# EAGLE design RGBdriverModule (EAGLE 4.16)
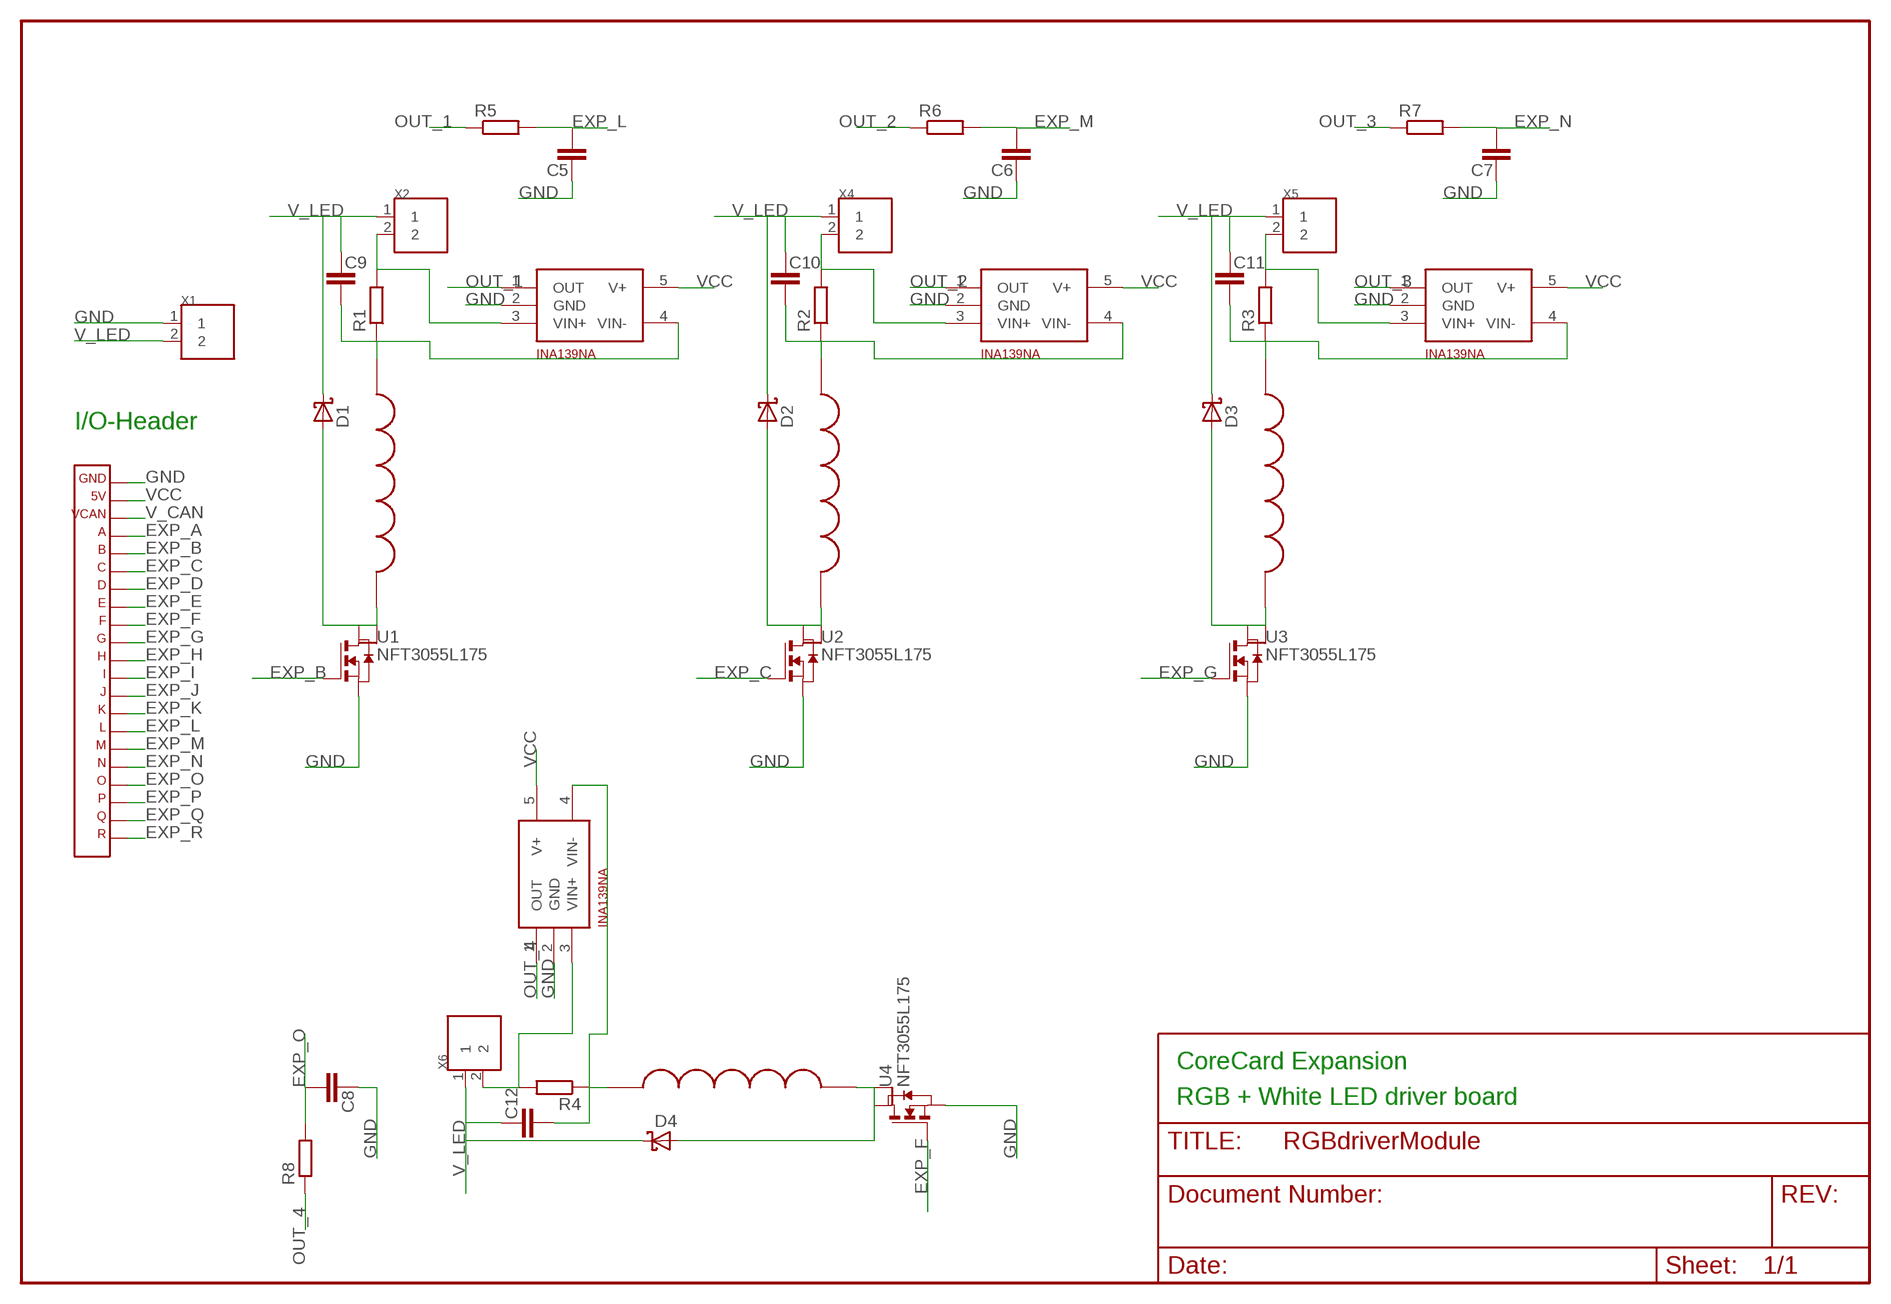
[diagram p0: schematic, sheet 1]

## Parts
C5  C-EUC0603  [C0603]
C6  C-EUC0603  [C0603]
C7  C-EUC0603  [C0603]
C8  C-EUC0603  [C0603]
C9  C-EUC1210  [C1210]
C10  C-EUC1210  [C1210]
C11  C-EUC1210  [C1210]
C12  C-EUC1210  [C1210]
D1  SCHOTTKY-DIODESMC  [SMC]
D2  SCHOTTKY-DIODESMC  [SMC]
D3  SCHOTTKY-DIODESMC  [SMC]
D4  SCHOTTKY-DIODESMC  [SMC]
R1  R-EUR0805  [R0805]
R2  R-EUR0805  [R0805]
R3  R-EUR0805  [R0805]
R4  R-EUR0805  [R0805]
R5  R-EUR0603  [R0603]
R6  R-EUR0603  [R0603]
R7  R-EUR0603  [R0603]
R8  R-EUR0603  [R0603]
U1  NFT3055L175  [SOT223]
U2  NFT3055L175  [SOT223]
U3  NFT3055L175  [SOT223]
U4  NFT3055L175  [SOT223]
U5  INA139NA  [SOT23-5]
U6  INA139NA  [SOT23-5]
U7  INA139NA  [SOT23-5]
U8  INA139NA  [SOT23-5]
U$2  10X10  [10X10]
U$5  10X10  [10X10]
U$8  10X10  [10X10]
U$11  10X10  [10X10]
X1  BLOCK2  [PCB2]
X2  BLOCK2  [PCB2]
X3  CORE_IOHEADEXP  [CORE_IOHEAD_NOSILC]
X4  BLOCK2  [PCB2]
X5  BLOCK2  [PCB2]
X6  BLOCK2  [PCB2]

## Nets
EXP_A: X3.4
EXP_B: U1.1(G) X3.5
EXP_C: U2.1(G) X3.6
EXP_D: X3.7
EXP_E: X3.8
EXP_F: U4.1(G) X3.9
EXP_G: U3.1(G) X3.10
EXP_H: X3.11
EXP_I: X3.12
EXP_J: X3.13
EXP_K: X3.14
EXP_L: C5.2 R5.2 X3.15
EXP_M: C6.2 R6.2 X3.16
EXP_N: C7.2 R7.2 X3.17
EXP_O: C8.2 R8.2 X3.18
EXP_P: X3.19
EXP_Q: X3.20
EXP_R: X3.21
GND: C5.1 C6.1 C7.1 C8.1 U1.3(S) U2.3(S) U3.3(S) U4.3(S) U5.2(GND) U6.2(GND) U7.2(GND) U8.2(GND) X1.1 X3.1
L1: D1.A U1.2(D) U1.4(D_PAD) U$2.P$2
L2: D2.A U2.2(D) U2.4(D_PAD) U$5.P$2
L3: D3.A U3.2(D) U3.4(D_PAD) U$8.P$2
L4: D4.A U4.2(D) U4.4(D_PAD) U$11.P$2
N$1: R2.2 U6.3(VIN+) X4.2
N$2: C10.2 R2.1 U6.4(VIN-) U$5.P$1
N$4: R1.2 U5.3(VIN+) X2.2
N$5: C9.2 R1.1 U5.4(VIN-) U$2.P$1
N$7: R3.2 U7.3(VIN+) X5.2
N$8: C11.2 R3.1 U7.4(VIN-) U$8.P$1
N$10: R4.2 U8.3(VIN+) X6.2
N$11: C12.2 R4.1 U8.4(VIN-) U$11.P$1
OUT_1: R5.1 U5.1(OUT)
OUT_2: R6.1 U6.1(OUT)
OUT_3: R7.1 U7.1(OUT)
OUT_4: R8.1 U8.1(OUT)
V_CAN: X3.3
V_LED: C9.1 C10.1 C11.1 C12.1 D1.C D2.C D3.C D4.C X1.2 X2.1 X4.1 X5.1 X6.1
VCC: U5.5(V+) U6.5(V+) U7.5(V+) U8.5(V+) X3.2

## Notes on the sheet
- I/O-Header
- CoreCard Expansion
- RGB + White LED driver board

## Library data of the parts
C5-C12 = rcl:C-EU
D1-D4 = diode:SCHOTTKY-DIODE: Schottky Diode
R1-R8 = rcl:R-EU
U1-U4 = NMOS_NTF3055L175:NFT3055L175
U5-U8 = texas_ina139na:INA139NA
U$2 U$5 U$8 U$11 = inductor10x10:10X10
X1 X2 X4-X6 = terminal_block:BLOCK2
X3 = expboard:CORE_IOHEAD: CoreCard IO-header for expansion cards

## Board
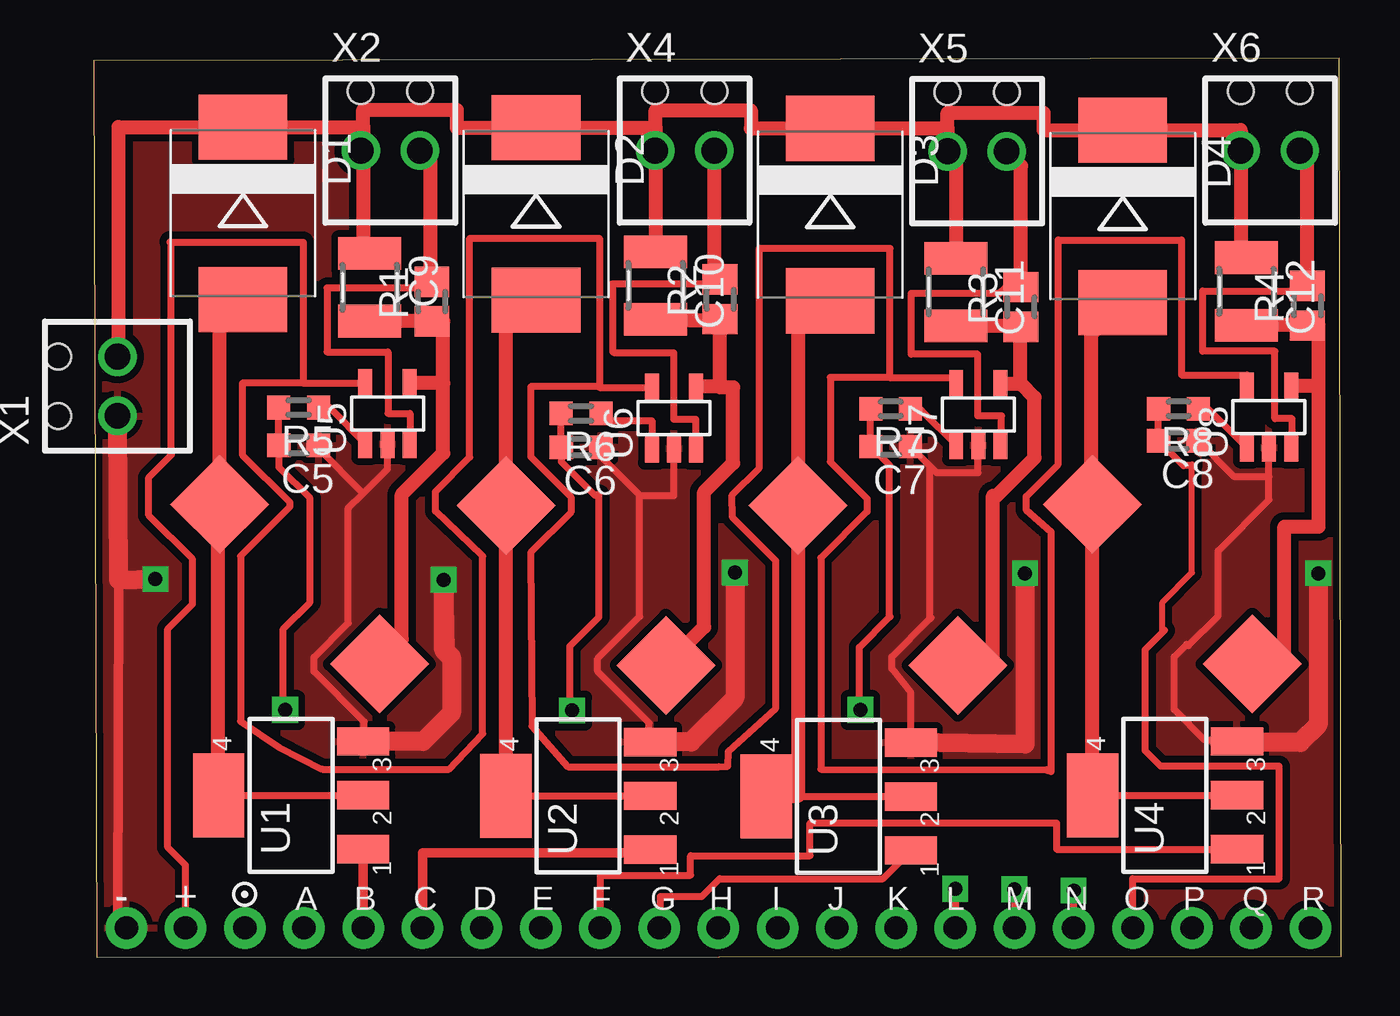
[diagram p1: board, top side]
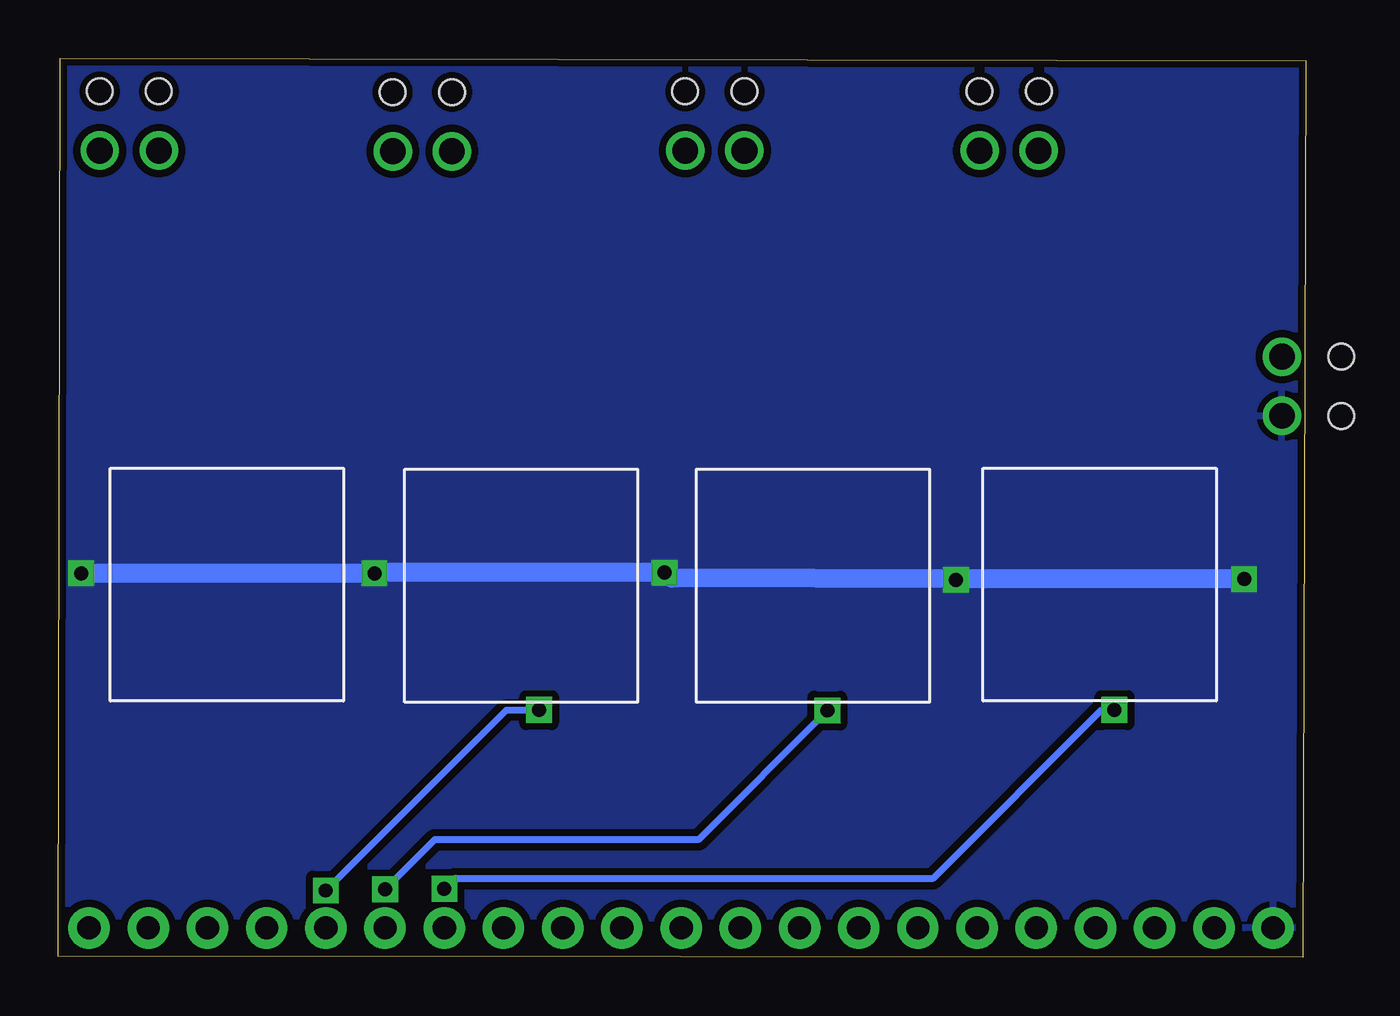
[diagram p2: board, bottom side, seen from below]

Size 53.52 x 38.58 mm. Coordinates in mm from the lower left corner, seen from the top.
Outline: 0.13,0 53.52,0.05 53.44,38.58 0,38.48 0.13,0
Copper layers (1*16): Top 0.035mm / dielectric 1.5mm / Bottom 0.035mm
Design rules "default": minimum track width 10mil, minimum drill 0.6mm, track to track 10mil, track to pad 10mil, pad to pad 10mil, via to via 10mil, smd to smd 8mil, copper to edge 10mil, drill to drill 8mil, minimum pad ring 10mil, minimum via ring 10mil, stop-mask expansion 4mil, vias tented up to drill 0mil, thermal gap 10mil

### Footprints (pad centres in the part's own frame; a part is rotated, then mirrored left to right if it is on the bottom)
C0603 = smd 1 x 1: 1 -0.85,0; 2 0.85,0
C1210 = smd 1.4 x 2.7: 1 -1.4,0; 2 1.5,0
SMC = smd 2.8 x 3.8: A 3.7,0; C -3.7,0
R0805 = smd 1.3 x 1.5: 1 -0.85,0; 2 0.85,0
R0603 = smd 0.991 x 1.016: 1 -0.85,0; 2 0.85,0
SOT223 = smd 1.219 x 2.235: 1 -2.311,-3.099; 2 0,-3.099; 3 2.311,-3.099 | smd 3.6 x 2.2: 4 0,3.099
SOT23-5 = smd 0.6 x 1.2: 1 -0.95,-1.306; 2 0,-1.306; 3 0.95,-1.306; 4 0.95,1.306; 5 -0.95,1.306
10X10 = smd 3 x 3 rotated 45: P$1 1.588,1.588; P$2 8.447,8.447
PCB2 = drill 1.1 round: 1 -2.54,0; 2 0,0 | hole 1.1: -2.54,2.54; 0,2.54
CORE_IOHEAD_NOSILC = drill 1 pad 1.778 round: 1 25.4,0; 2 22.86,0; 3 20.32,0; 4 17.78,0; 5 15.24,0; 6 12.7,0; 7 10.16,0; 8 7.62,0; 9 5.08,0; 10 2.54,0; 11 0,0; 12 -2.54,0; 13 -5.08,0; 14 -7.62,0; 15 -10.16,0; 16 -12.7,0; 17 -15.24,0; 18 -17.78,0; 19 -20.32,0; 20 -22.86,0; 21 -25.4,0

### Placement (x,y rotation side)
C5  8.79,21.97 180 top
C6  20.9,21.89 180 top
C7  34.19,21.92 180 top
C8  46.53,22.17 180 top
C9  11.84,28.8 270 top
C10  24.1,28.88 270 top
C11  36.98,28.6 270 top
C12  49.45,28.63 270 top
D1  6.4,31.93 270 top
D2  18.97,31.9 270 top
D3  31.6,31.88 270 top
D4  44.15,31.8 270 top
R1  14.5,28.14 90 top
R2  26.87,28.24 90 top
R3  39.78,27.91 90 top
R4  52.07,27.97 90 top
R5  8.79,23.6 180 top
R6  20.9,23.34 180 top
R7  34.19,23.55 180 top
R8  46.53,23.55 180 top
U1  8.46,6.96 90 top
U2  20.78,6.93 90 top
U3  31.95,6.91 90 top
U4  45.95,6.96 90 top
U5  12.6,23.34 0 top
U6  24.89,23.14 0 top
U7  37.95,23.29 0 top
U8  50.42,23.19 0 top
U$2  13.84,11 90 top
U$5  26.14,10.95 90 top
U$8  38.66,10.95 90 top
U$11  51.28,11 90 top
X1  1.02,25.78 90 top
X2  14,34.62 0 top
X3  26.8,1.27 0 bottom
X4  26.62,34.62 0 top
X5  39.17,34.59 0 top
X6  51.74,34.62 0 top

### Tracks (layer width: path | path; a pad name or v marks a point on that pad's centre or on a via)
EXP_B
  Top 0.406: U1.1 X3.5 11.63,1.27
EXP_C
  Top 0.406: U2.1 23.88,4.5 14.1,4.5 X3.6
EXP_F
  Top 0.305: U4.1 41.3,4.65 41.3,5.77 30.73,5.77 30.73,4.37 25.6,4.37 25.6,3.53 21.74,3.53 21.74,1.27 | 21.74,1.27 21.74,1.17 | X3.9 21.74,1.27
EXP_G
  Top 0.305: X3.10 24.31,1.27 24.31,2.62 26.09,2.62 26.85,3.38 33.86,3.38 35.08,4.6 U3.1
EXP_L  (via drill 0.6)
  Top 0.305: v8.2,10.62 8.13,10.69 8.13,14.1 9.27,15.24 9.27,19.71 7.94,21.04 7.94,21.96 | 36.96,1.25 X3.15 | v36.96,2.95 36.96,1.25 | 36.96,1.25 37.06,1.14 | C5.2 7.94,21.96 | 7.94,21.96 R5.2 | 7.94,21.96 7.95,21.95
  Bottom 0.305: v8.2,10.62 8.76,10.62 16,3.38 36.53,3.38 v36.96,2.95
EXP_M  (via drill 0.6)
  Top 0.305: v20.52,10.59 20.42,10.69 20.42,13.36 21.67,14.61 21.67,19.84 21.49,19.84 20.07,21.26 20.07,21.84 20.05,21.86 C6.2 | 39.5,1.22 X3.16 | v39.5,2.92 39.5,1.22 | 39.5,1.22 39.55,1.17 | C6.2 R6.2 | C6.2 20.07,21.87
  Bottom 0.305: v20.52,10.59 26.06,5.05 37.36,5.05 v39.5,2.92
EXP_N  (via drill 0.6)
  Top 0.305: 34.14,14.61 32.84,13.31 32.84,10.67 v32.89,10.62 | 34.14,14.61 34.16,14.63 | v42.04,2.87 X3.17 42.06,1.25 | 33.33,21.91 33.33,21.87 | 33.33,21.91 C7.2 34.14,21.12 34.14,14.61 | R7.2 33.33,23.53 33.33,21.91
  Bottom 0.305: v32.89,10.62 34.29,10.62 v42.04,2.87
EXP_O
  Top 0.254: 47.12,21.11 47.12,16.51 45.85,15.24 45.85,13.97 45.86,13.96
  Top 0.305: 45.94,14.04 45.86,13.96 45.11,13.21 45.11,8.87 45.77,8.2 50.85,8.2 50.85,3.38 44.58,3.38 X3.18 44.58,1.17 | 45.67,22.16 45.67,22.15 | 45.67,22.16 C8.2 46.75,21.11 47.12,21.11 47.12,21.13 | R8.2 45.67,23.53 45.67,22.16
GND  (via drill 0.6)
  Top 0.305: U3.3 35.05,11.38 34.24,12.39 34.24,12.9 35.85,14.52 | 35.85,14.52 35.92,14.58 | U4.3 49,9.27 48.97,9.25 48.9,9.32 47.68,9.32 46.36,10.64 46.36,12.9 46.89,13.44 46.94,13.39 46.97,13.39 48.23,14.66 48.23,17.45 50.42,19.63 50.42,20.62 | U2.3 23.88,9.27 23.82,9.32 23.82,10.06 21.61,12.27 21.61,12.83 23.42,14.63 23.42,19.81 23.44,19.81 | U1.3 11.61,9.27 11.61,10.11 9.45,12.27 9.45,12.88 10.92,14.35 10.92,19.25 10.9,19.25 11.56,19.91 | 50.42,20.62 U8.2 | C8.1 48.93,20.62 50.42,20.62 | U7.2 37.92,21.96 37.92,20.83 37.95,20.8 36.16,20.8 C7.1 35.87,21.09 35.87,14.5 35.85,14.52 | 23.44,19.81 24.89,19.81 24.89,21.79 | 24.89,21.79 U6.2 | 24.89,21.79 24.87,21.79 | C6.1 21.75,21.5 23.44,19.81 | U5.2 12.6,20.95 11.56,19.91 | C5.1 9.64,21.83 11.56,19.91
  Top 0.406: U3.3 36.45,9.22 | X3.1 1.4,1.37 1.02,1.75 1.07,16.2
  Top 0.813: 23.8,9.25 U2.3 25.63,9.25 27.51,11.12 v27.51,16.51 | v39.95,16.48 39.95,9.14 U3.3 | 49.05,9.22 48.84,9.22 | 49.05,9.22 U4.3 | v52.53,16.48 52.53,9.98 51.77,9.22 49.05,9.22 | X1.1 1.07,16.2 v2.64,16.23 | v15.01,16.2 15.06,13.18 15.34,12.9 | 15.34,12.9 15.34,10.49 14.12,9.27 11.74,9.27 11.71,9.25 11.68,9.27 U1.3 | 15.34,12.9 15.29,12.9 15.01,13.18 15.01,16.28
  Bottom 0.813: v52.53,16.48 v39.95,16.48 39.85,16.51 39.83,16.54 39.8,16.51 v27.51,16.51 27.51,16.54 27.48,16.56 27.2,16.28 14.91,16.23 | v2.64,16.23 14.91,16.23 | 14.91,16.23 15.01,16.23 v15.01,16.2
  pour Bottom (isolate 0.305, rank 3): 0.05,38.43 53.37,38.43 53.52,11.81 53.47,1.14 0.13,1.14
  pour Top (isolate 0.305, rank 3): 0.13,38.4 53.37,38.43 53.52,11.43 53.47,1.14 0.13,1.14
L1
  Top 0.305: U1.4 5.49,6.96 5.59,6.86 5.69,6.96 U1.2
  Top 0.61: 5.41,19.45 5.41,19.36 | 5.41,19.45 U$2.P$2 5.33,19.45 5.33,6.96 | D1.A 5.41,28.23 5.41,19.45 | 5.33,6.96 5.33,6.81 | U1.4 5.33,6.96
L2
  Top 0.305: U2.4 U2.2
  Top 0.61: U2.4 | U2.4 U$5.P$2 17.69,28.02 18.97,28.02 D2.A
L3
  Top 0.305: 30.23,6.93 30.38,6.93 30.4,6.91 U3.2
  Top 0.61: 30.23,19.38 30.23,19.3 | D3.A 30.23,28.18 30.23,19.39 | 30.23,19.38 30.23,19.39 | 30.23,19.39 U$8.P$2 | U3.4 30.23,6.93 30.23,19.38
L4
  Top 0.305: 49.2,6.96 U4.2 | U4.4 49.2,6.96 | 49.2,6.96 49.23,6.99
  Top 0.61: 42.8,19.41 42.8,19.28 | 42.8,19.41 U$11.P$2 42.85,19.43 U4.4 | D4.A 42.8,26.75 42.8,19.41 | U4.4
N$1
  Top 0.305: R2.2 26.68,28.91 22.25,28.91 22.28,28.88 22.28,25.98 22.33,25.93 24.89,25.93 24.89,23.09 25.83,23.09 25.83,21.84 25.84,21.84 U6.3
  Top 0.61: R2.2 26.87,29.03 26.62,29.03 X4.2
N$2
  Top 0.61: 24.56,12.54 U$5.P$1 26.19,14.17 26.19,19.96 27.43,21.21 27.43,24.46 26.87,24.46 26.87,24.49 | C10.2 24.11,27.33 26.87,27.33 R2.1 26.87,24.49 | U6.4 25.84,24.49 26.87,24.49
N$4
  Top 0.305: R1.2 14.11,28.99 13.84,28.73 10.01,28.73 10.01,25.98 12.62,25.98 12.62,23.34 13.56,23.34 13.56,22.04 | 13.56,21.97 13.56,22.04 | 13.56,22.04 U5.3
  Top 0.61: 14.45,28.99 14.45,28.91 | R1.2 14.45,28.99 | X2.2 14.45,34.62 14.45,28.99
N$5
  Top 0.61: 14.53,27.3 14.53,27.29 R1.1 14.99,27.29 14.99,24.64 | 14.53,27.3 C9.2 | 14.53,27.3 14.53,27.33 | 14.99,24.64 14.99,21.64 13.21,19.86 13.21,13.66 12.24,12.7 12.26,12.69 U$2.P$1 | U5.4 14.98,24.65 14.99,24.64
N$7
  Top 0.305: R3.2 39.13,28.77 38.86,28.5 35.08,28.5 35.08,25.88 37.92,25.88 37.92,23.24 38.94,23.24 38.94,21.99 | 38.94,21.99 38.94,21.97 | U7.3 38.94,21.99
  Top 0.61: X5.2 39.17,34.57 39.78,33.96 R3.2
N$8
  Top 0.61: C11.2 39.68,27.1 39.75,27.03 R3.1 39.75,27.07 39.75,24.6 | 39.75,24.6 U7.4 | U$8.P$1 38.58,12.54 38.58,19.81 38.73,19.81 40.36,21.44 40.36,24.03 39.79,24.6 39.75,24.6
N$10
  Top 0.305: R4.2 51.56,28.82 51.56,28.6 47.57,28.6 47.57,26.01 50.67,26.01 50.67,23.11 51.41,23.11 51.41,21.88 U8.3
  Top 0.61: 52.07,28.8 R4.2 52.07,34.62 X6.2
N$11
  Top 0.61: 49.99,12.59 49.99,12.55 | U$11.P$1 49.99,12.59 | 49.99,12.59 51.08,12.59 51.08,18.49 52.55,18.49 52.55,24.51 | U8.4 51.46,24.5 51.46,24.51 52.55,24.51 | R4.1 52.07,27.05 | C12.2 R4.1 | R4.1 52.55,27.11 52.55,24.51
OUT_1
  Top 0.305: 11.68,22.02 11.67,22.04 | 11.67,22.04 U5.1 | R5.1 10.11,23.6 11.67,22.04
OUT_2
  Top 0.305: R6.1 21.75,23.04 23.94,23.04 U6.1
OUT_3
  Top 0.305: R7.1 35.03,23.53 35.03,23.47 35.51,23.47 U7.1
OUT_4
  Top 0.305: R8.1 47.43,23.5 47.86,23.5 U8.1
V_LED
  Top 0.61: X5.1 36.63,34.54 | 36.63,35.58 D3.C 28.19,35.58 28.19,36.35 24.11,36.35 24.11,35.6 | 36.63,35.58 X5.1 | 36.63,35.58 36.63,36.25 40.74,36.25 40.74,35.5 D4.C 49.2,35.5 X6.1 49.2,30.03 C12.1 | 11.56,35.63 D1.C 1.07,35.63 1.07,25.78 | 11.56,35.63 11.56,34.62 | 24.11,34.62 24.11,34.59 | 24.11,34.59 24.11,34.54 | 24.11,34.62 X4.1 24.08,34.59 24.11,34.59 | 24.11,35.6 D2.C 15.57,35.6 15.57,36.37 11.56,36.37 11.56,35.63 | 24.11,35.6 24.11,34.62 | 1.07,25.78 1.07,25.73 | X1.2 1.07,25.78 | X5.1 36.63,34.52 36.98,34.16 C11.1 | 24.11,34.59 C10.1 | 11.56,34.62 X2.1 | C9.1 11.56,30.2 11.56,34.62
VCC
  Top 0.305: 34.14,30.43 28.55,30.43 28.55,21.01 27.38,19.84 27.41,18.87 29.26,17.02 29.26,10.69 27.23,8.84 27.2,8.2 26.82,8.18 20.34,8.18 18.8,9.93 18.74,17.3 18.74,17.37 20.47,19.1 20.47,19.76 18.74,21.49 18.74,24.49 21.77,24.49 21.77,24.46 | 41.38,30.76 41.38,21.16 40.01,19.79 40.01,19.2 41.07,18.26 41.07,7.98 40.87,8.05 31.19,8.08 31.19,17.14 33.17,19.13 33.17,19.68 31.6,21.26 31.6,24.89 34.14,24.89 | 41.38,30.76 41.4,30.79 | X3.2 3.94,3.96 3.17,4.72 3.17,14.1 4.24,15.16 4.24,17.09 2.36,18.97 2.36,20.6 3.33,21.57 3.33,30.68 3.28,30.68 | 41.38,30.76 41.38,30.79 46.66,30.79 46.66,24.99 49.48,24.99 49.48,24.5 U8.5 | 34.14,30.43 34.16,30.43 | 34.14,30.43 34.14,24.89 | U7.5 36.96,24.6 36.96,24.89 34.14,24.89 | U6.5 23.98,24.46 | U6.5 | 21.77,24.46 21.69,24.46 21.69,30.86 16.13,30.86 16.13,21.46 14.66,19.99 14.66,19.15 16.69,17.22 16.69,9.6 15.24,8.08 9.8,8.08 7.96,9 6.3,10.13 6.3,17.22 8.41,19.33 8.41,19.53 6.38,21.57 6.38,24.64 8.99,24.64 8.99,24.65 | 21.77,24.46 U6.5 | 8.99,24.65 U5.5 | 8.99,24.65 8.99,30.68 3.28,30.68 | 3.28,30.68 3.28,30.71

### Text on the board
tPlace: - | + | A | B | C | D | E | F | G | H | I | J | K | L | M | N | O | P | Q | R
Document: Top is component side | Expansion will be mounted bottom to bottom with CoreCard | Change vertical dimension to fit | Remove I/O-header silcscreen if neccesary | Remove mounting holes if neccesary